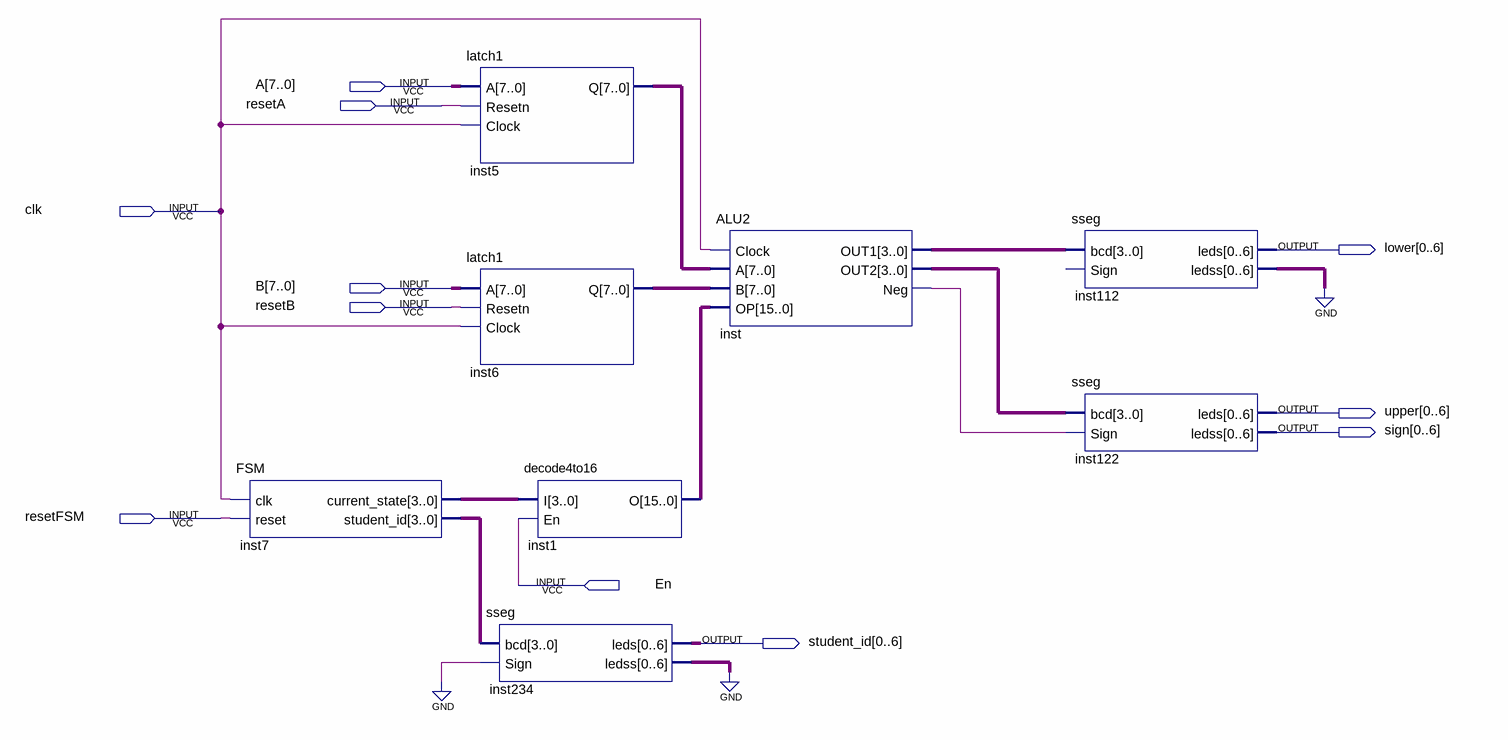
[diagram p0: schematic sheet]
// Quartus schematic lab6pt2.bdf as structural Verilog: 8 symbols, 11 pins
module lab6pt2 (
  input  [7:0] A,
  input  resetA,
  input  clk,
  input  [7:0] B,
  input  resetB,
  input  resetFSM,
  input  En,
  output [0:6] lower,
  output [0:6] upper,
  output [0:6] sign,
  output [0:6] student_id
);

  wire inst_neg;
  wire [3:0] inst7_current_state, inst7_student_id, inst_out1, inst_out2;
  wire [6:0] inst112_ledss, inst234_ledss;
  wire [7:0] inst5_q, inst6_q;
  wire [15:0] inst1_o;

  FSM inst7 (.clk(clk), .reset(resetFSM), .current_state(inst7_current_state), .student_id(inst7_student_id));
  latch1 inst5 (.A(A), .Resetn(resetA), .Clock(clk), .Q(inst5_q));
  latch1 inst6 (.A(B), .Resetn(resetB), .Clock(clk), .Q(inst6_q));
  sseg inst234 (.bcd(inst7_student_id), .Sign(1'b0), .leds(student_id), .ledss(inst234_ledss));
  decode4to16 inst1 (.I(inst7_current_state), .En(En), .O(inst1_o));
  ALU2 inst (.Clock(clk), .A(inst5_q), .B(inst6_q), .OP(inst1_o), .OUT1(inst_out1), .OUT2(inst_out2), .Neg(inst_neg));
  sseg inst112 (.bcd(inst_out1), .leds(lower), .ledss(inst112_ledss));  // open: Sign
  sseg inst122 (.bcd(inst_out2), .Sign(inst_neg), .leds(upper), .ledss(sign));
  // also tied to GND on the sheet: {inst112_ledss[0], inst112_ledss[1], inst112_ledss[2], inst112_ledss[3], inst112_ledss[4], inst112_ledss[5], inst112_ledss[6], inst234_ledss[0], inst234_ledss[1], inst234_ledss[2], inst234_ledss[3], inst234_ledss[4], inst234_ledss[5], inst234_ledss[6]}
endmodule
